# Altium project CHRT.PrjPcb
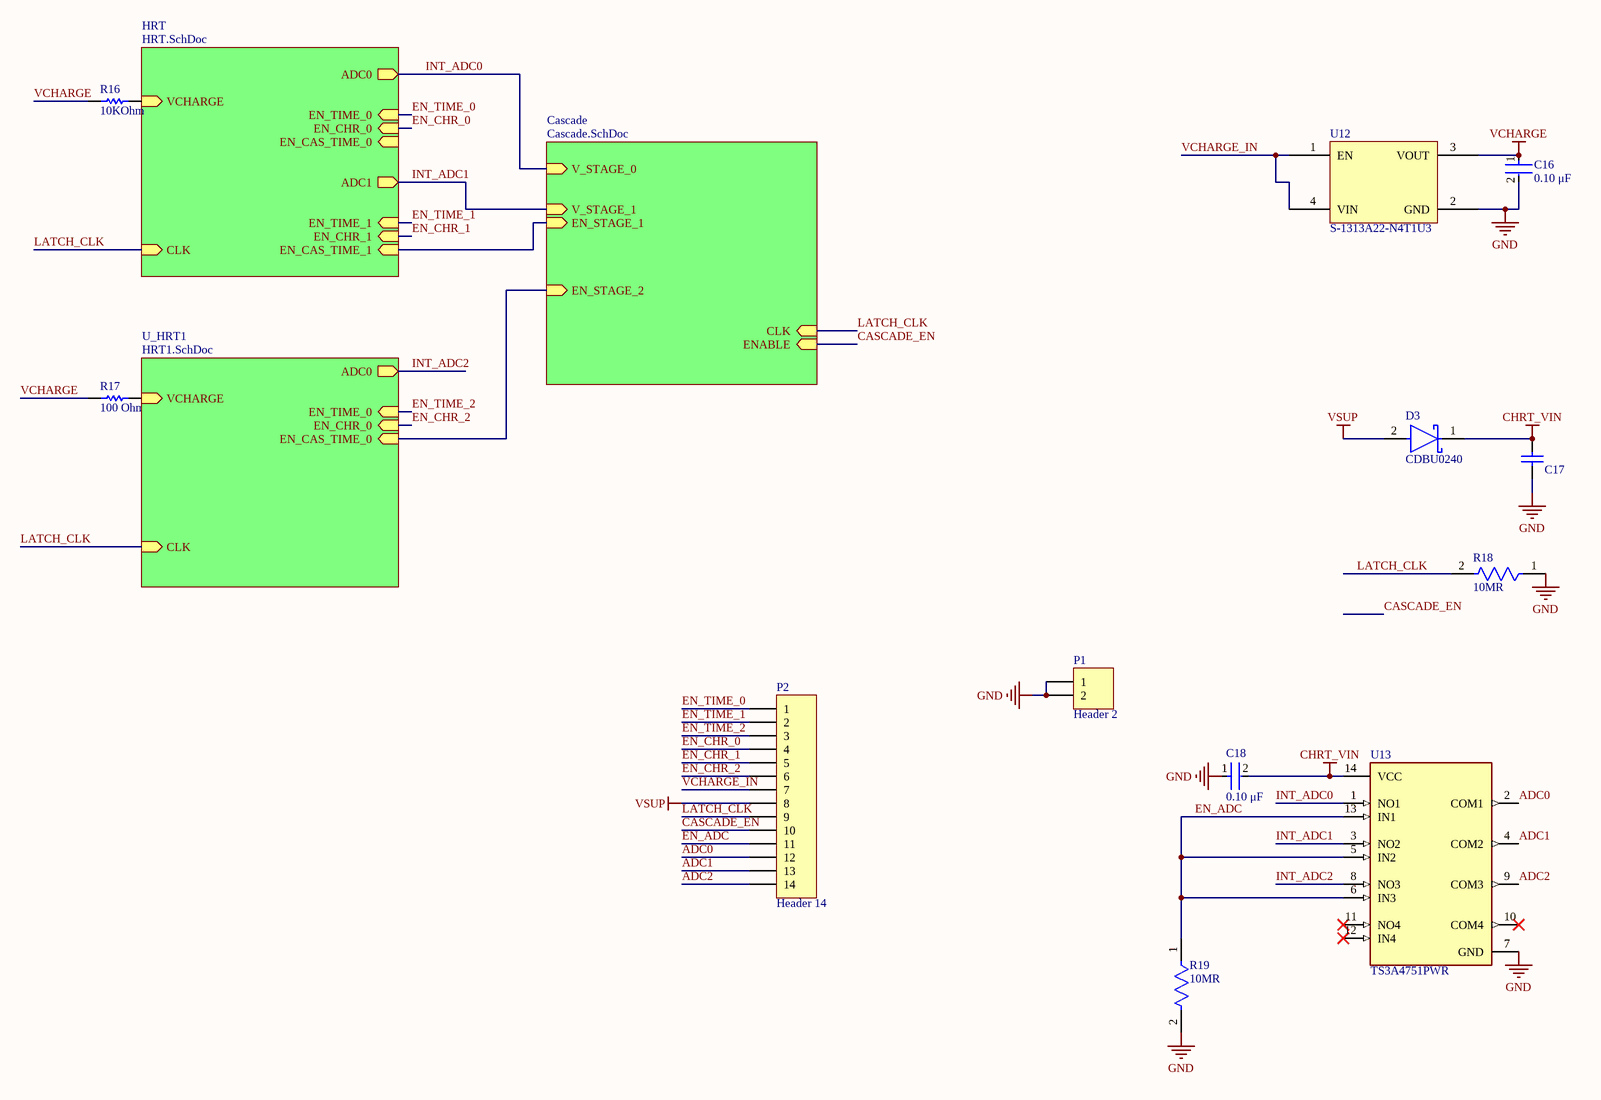
[diagram p0: CHRT.SchDoc]
4 sheets, 55 parts. Net scope: hierarchical (ports join the sheet entries above them; power ports are global).
Board file: PCB1.PcbDoc
Sheets:
  CHRT.SchDoc
    HRT = HRT.SchDoc
    Cascade = Cascade.SchDoc
    U_HRT1 = HRT1.SchDoc

## Sheet CHRT.SchDoc
size A3; SheetNumber: 1; SheetTotal: 4

### Parts
C16  Capacitance: 0.10 μF  [FP-C0402-BB-MFG]  (hidden comment: C0402C104K8PACTU)
C17  ZRB15XR61A106ME01D  [CAPC1005X55X25NL05T10]  (value not drawn)
C18  Capacitance: 0.10 μF  [FP-C0402-BB-MFG]  (hidden comment: C0402C104K8PACTU)
D3  CDBU0240  [FP-SOD-523F-MFG]
P1  Header 2  [HDR1X2]
P2  Header 14  [HDR1X14]
R16  Resistance: 10KOhm  [RESC1005X40X25LL05T05]  (hidden comment: RMCF0402FT10K0)
R17  Resistance: 100 Ohm  [RESC1005X40X25LL05T05]  (hidden comment: ERJ-2RKF1000X)
R18  Resistance: 10MR  [FP-CRCW0402-e3-IPC_C]  (hidden comment: CRCW040210M0JNED)
R19  Resistance: 10MR  [FP-CRCW0402-e3-IPC_C]  (hidden comment: CRCW040210M0JNED)
U12  S-1313A22-N4T1U3  [SC82AB]
U13  TS3A4751PWR  [FP-PW0014A-IPC_C]

### Sub-sheets
Cascade = Cascade.SchDoc: V_STAGE_0 (in), V_STAGE_1 (in), EN_STAGE_1 (in), EN_STAGE_2 (in), CLK (in), ENABLE (in)
HRT = HRT.SchDoc: VCHARGE (in), CLK (in), ADC0 (out), EN_TIME_0 (in), EN_CHR_0 (in), EN_CAS_TIME_0 (in), ADC1 (out), EN_TIME_1 (in), EN_CHR_1 (in), EN_CAS_TIME_1 (in)
U_HRT1 = HRT1.SchDoc: VCHARGE (in), CLK (in), ADC0 (out), EN_TIME_0 (in), EN_CHR_0 (in), EN_CAS_TIME_0 (in)

### Nets
CHRT_VIN: C17.2 C18.2 D3.1(C) U13.14(VCC)
GND: C16.2 C17.1 C18.1 P1.1 P1.2 R18.1 R19.2 U12.2(GND) U13.7(GND)
VCHARGE: C16.1 R16.1 R17.1 U12.3(VOUT)
VSUP: D3.2(A) P2.8
ADC0: P2.12 U13.2(COM1)
ADC1: P2.13 U13.4(COM2)
ADC2: P2.14 U13.9(COM3)
CASCADE_EN: P2.10 ; sheet Cascade/ENABLE
EN_ADC: P2.11 R19.1 U13.5(IN2) U13.6(IN3) U13.13(IN1)
EN_CHR_0: P2.4 ; sheet HRT/EN_CHR_0
EN_CHR_1: P2.5 ; sheet HRT/EN_CHR_1
EN_CHR_2: P2.6 ; sheet U_HRT1/EN_CHR_0
EN_TIME_0: P2.1 ; sheet HRT/EN_TIME_0
EN_TIME_1: P2.2 ; sheet HRT/EN_TIME_1
EN_TIME_2: P2.3 ; sheet U_HRT1/EN_TIME_0
INT_ADC0: U13.1(NO1) ; sheet HRT/ADC0, sheet Cascade/V_STAGE_0
INT_ADC1: U13.3(NO2) ; sheet HRT/ADC1, sheet Cascade/V_STAGE_1
INT_ADC2: U13.8(NO3) ; sheet U_HRT1/ADC0
LATCH_CLK: P2.9 R18.2 ; sheet HRT/CLK, sheet Cascade/CLK, sheet U_HRT1/CLK  [project net CLK]
VCHARGE_IN: P2.7 U12.1(EN) U12.4(VIN)
NetD1_2: R16.2 ; sheet HRT/VCHARGE
NetD2_2: R17.2 ; sheet U_HRT1/VCHARGE
NetR6_2: sheet HRT/EN_CAS_TIME_1, sheet Cascade/EN_STAGE_1
NetR12_2: sheet Cascade/EN_STAGE_2, sheet U_HRT1/EN_CAS_TIME_0

Not connected (* = marked no-connect by the designer): U13 10(COM4)* 11(NO4)* 12(IN4)*

### Library data of the parts
C16 C18 = CMP-2008-02046-2: CAP CER 0.1UF 10V X5R 0402; Manufacturer: Kemet; Material: Ceramic; Temperature Coefficient: 15%; Tolerance: 0.1; Value: 0.10 μF; Package: C0402-BB; Temperature: -55°C to +125°C; ComponentLink2Description: Datasheet; Temperature Characteristic: X5R; Device Class L1: Passive Components; Height: 0.55mm; Lead Free: Yes; ComponentLink2URL: https://content.kemet.com/datasheets/KEM_C1002_X7R_SMD.pdf; Device Class L2: Capacitors; Temperature Range Low: -55°C; Temperature Range High: +125°C; RoHS: TRUE; Octopart: https://octopart.com/c0402c104k8pactu-kemet-140039; Automotive: No; Mouser Description: Capacitor 100 nF 10 VDC 0402; Category: Cap; Voltage Rating: 10 V; Digikey Description: CAP CER 0.1UF 10V X5R 0402; Ipc Land Pattern Name: CAPC10050X50; Device Class L3: Ceramic Capacitors; Manufacturer Part Number: C0402C104K8PACTU
C17 = CMP-2008-04012-1: Manufacturer: Murata; Part Number: GRM155R60G106ME44D; Capacitance: 10uF
D3 = CMP-20227-000007-1: DIODE SCHOTTKY 40V 200MA 0603; Max Reverse Leakage Current: 1uA; Max Surge Current: 2A; Polarity: Standard; Max Power Dissipation: 150mW; Capacitance: 9pF; Voltage Rating (DC): 40V; Average Rectified Current: 200mA; RoHS Compliant: Yes; Package Quantity: 1; Current Rating: 200mA; Lead Free: Lead Free; Output Current: 200mA; Case/Package: SMD/SMT; Mount: Surface Mount; Packaging: Tape and Reel; Max Reverse Voltage (DC): 40V
P1 = Header 2: Header, 2-Pin; LatestRevisionDate: 17-Jul-2002; LatestRevisionNote: Re-released for DXP Platform.; Publisher: Altium Limited
P2 = Header 14: Header, 14-Pin; LatestRevisionDate: 17-Jul-2002; LatestRevisionNote: Re-released for DXP Platform.; Publisher: Altium Limited
R16 = CMP-2000-07588-1: Chip Resistor, 10 KOhm, +/- 1%, 0.1 W, -55 to 155 degC, 0402 (1005 Metric), RoHS, Tape and Reel; Manufacturer: Panasonic; Power Rating: 100mW; Voltage Rating: 50V; Case\/Package: 0402; Temperature Coefficient: 100ppm\/degreesC; RoHSCompliant: True; Lead Free: LeadFree; Package Quantity: 1; Contact Plating: Tin; Length: 1mm; Radiation Hardening: No; REACH SVHC: NoSVHC; Max Operating Temperature: 155degC; Depth: 0.5mm; Case Code (Imperial): 0402; Military Standard: Not; Package Description: 2-Pin Surface Mount Device, Body 1 x 0.5 mm; Termination: SMD/SMT; Case Code (Metric): 1005; Height: 0.35mm; Packaging: TapeandReel; Voltage Rating (DC): 50V; Package Reference: 402; Number of Pins: 2; Tolerance: 1%; Mounting Technology: SurfaceMount; Width: 0.02inch; Mount: SurfaceMount; Datasheet URL: https://industrial.panasonic.com/cdbs/www-data/pdf/RDA0000/AOA0000C304.pdf; Composition: ThickFilm; Datasheet Version: 02/2017; Manufacturer URL: http://www.panasonic.com/; Max Power Dissipation: 100mW; Number of Terminations: 2; Min Operating Temperature: -55degC
R17 = CMP-2002-00605-3: Chip Resistor, 100 Ohm, +/- 1%, 100 mW, -55 to 155 degC, 0402 (1005 Metric), RoHS, Tape and Reel; Manufacturer: Basic Passives; Power Rating: 100 mW; Voltage Rating: 50 V; Case\/Package: 0402; Width: 0.5 mm; Pins: 2; ComponentLink2Description: Datasheet; PackageReference: 0402; Height: 0.35 mm; Tolerance: 1%; DatasheetVersion: 04/2015; Case Code (Imperial): 0402; Min Operating Temperature: -55 degC; Radiation Hardening: No; Length: 1 mm; Package Quantity: 10000; PackageDescription: 2-Pin Surface Mount Device, Body 1 x 0.5 mm; Mounting Technology: Surface Mount; Case Code (Metric): 1005; Packaging: Tape and Reel; ComponentLink1URL: http://www.panasonic.com/; RoHSCompliant: true; Max Operating Temperature: 155 degC; REACH SVHC: Yes; PartNumber: ERJ-2RKF1000X; ComponentLink1Description: Manufacturer URL; ComponentLink2URL: http://industrial.panasonic.com/cdbs/www-data/pdf/RDA0000/AOA0000C86.pdf; Mount: Surface Mount
R18 R19 = CMP-1011-00170-3: RES Thick Film, 10MΩ, 5%, 0.063W, 200ppm/°C, 0402; Voltage Rating (DC): 50V; Max Power Dissipation: 63mW; Case Code (Metric): 1005; Tolerance: 5%; Lead Free: Lead Free; Length: 1mm; Packaging: Tape and Reel; Depth: 0.5mm; Composition: Thick Film; Temperature Coefficient: 200ppm/°C; Package Quantity: 1; Radiation Hardening: No; Weight: 2.3E-05oz; Width: 0.5mm; Military Standard: Not; Power Rating: 63mW; Case/Package: 0402; Termination: SMD/SMT; Height: 0.016inch; Voltage Rating: 50V; Contact Plating: Tin; Number of Terminations: 2; Features: Automotive AEC-Q200; Max Operating Temperature: 155°C; Case Code (Imperial): 0402; Min Operating Temperature: -55°C
U13 = CMP-04892-000059-1: IC SWITCH QUAD SPST 14TSSOP; Bandwidth: 125MHz; High Level Output Current: 100mA; Max Supply Voltage: 3.6V; Operating Supply Voltage: 3V; Polarity: Non-Inverting; Turn-Off Delay Time: 9ns; On-State Resistance: 900mR; Supply Type: Single; Max Supply Current: 75nA; Number of Inputs: 4; Turn-On Delay Time: 14ns; Min Supply Voltage: 1.6V; Packaging: Tape and Reel; Contact Plating: Gold; Mount: Surface Mount; Low Level Output Current: 100mA; Termination: SMD/SMT; Min Operating Temperature: -40°C; Case/Package: TSSOP; REACH SVHC: No SVHC; Weight: 0.002018oz; Number of Pins: 14; Throw Configuration: SPST; Height: 1.05mm; Radiation Hardening: No; Length: 5.1mm; Max Operating Temperature: 85°C; Package Quantity: 1; Lead Free: Lead Free; RoHS Compliant: Yes; Number of Channels: 4; Number of Outputs: 4; Width: 4.5mm

## Sheet HRT.SchDoc
size A; SheetNumber: 2; SheetTotal: 4
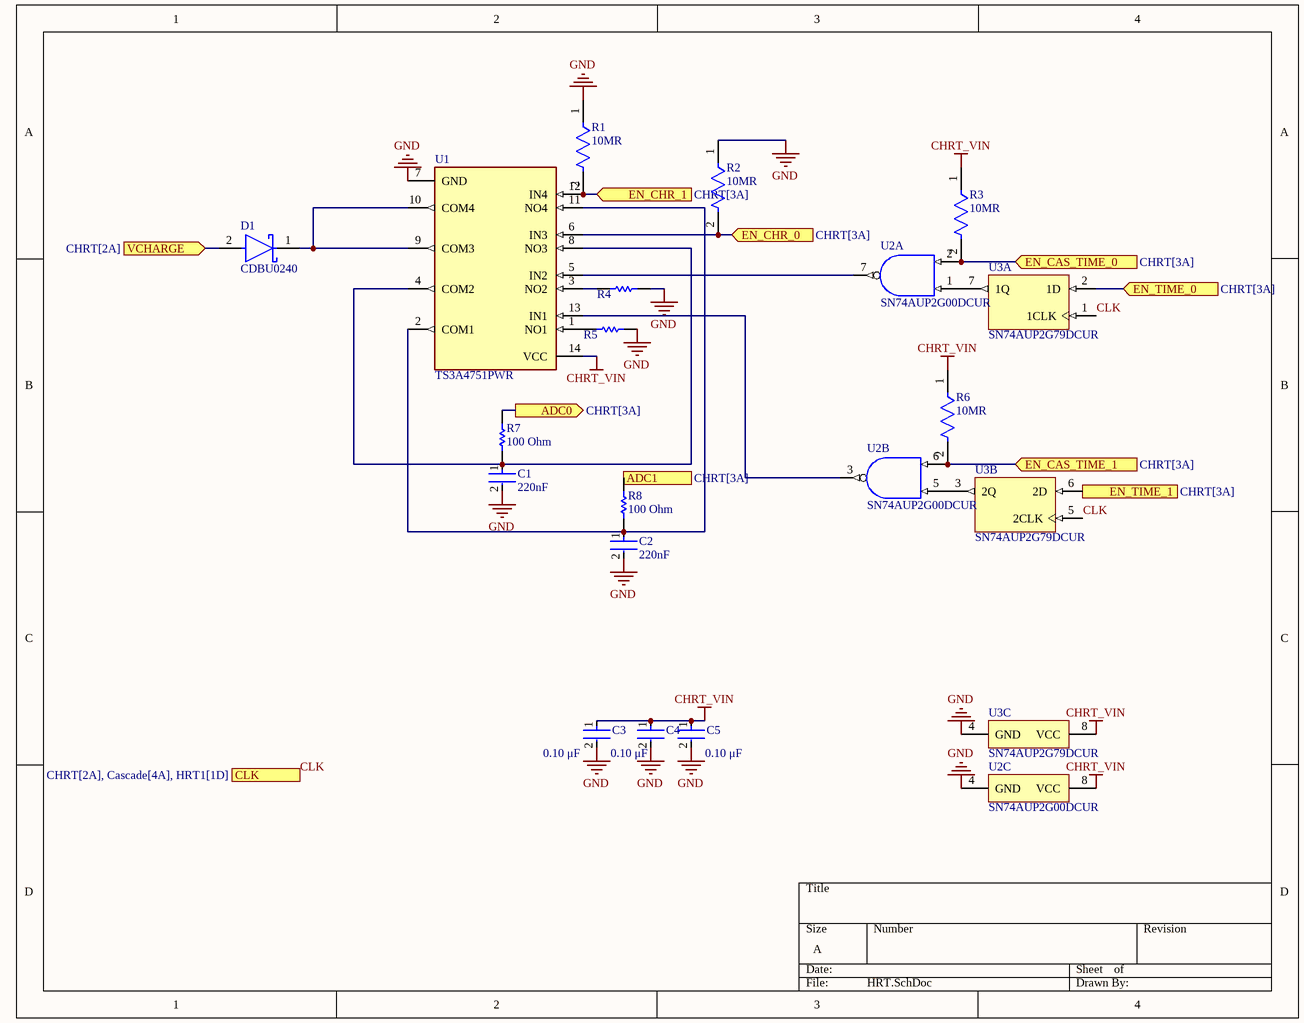
[diagram p1: HRT.SchDoc]

### Parts
C1  Capacitance: 220nF  [FP-GRM155-0_05-IPC_C]  (hidden comment: GRM155R71C224KA12D)
C2  Capacitance: 220nF  [FP-GRM155-0_05-IPC_C]  (hidden comment: GRM155R71C224KA12D)
C3  Capacitance: 0.10 μF  [FP-C0402-BB-MFG]  (hidden comment: C0402C104K8PACTU)
C4  Capacitance: 0.10 μF  [FP-C0402-BB-MFG]  (hidden comment: C0402C104K8PACTU)
C5  Capacitance: 0.10 μF  [FP-C0402-BB-MFG]  (hidden comment: C0402C104K8PACTU)
D1  CDBU0240  [FP-SOD-523F-MFG]
R1  Resistance: 10MR  [FP-CRCW0402-e3-IPC_C]  (hidden comment: CRCW040210M0JNED)
R2  Resistance: 10MR  [FP-CRCW0402-e3-IPC_C]  (hidden comment: CRCW040210M0JNED)
R3  Resistance: 10MR  [FP-CRCW0402-e3-IPC_C]  (hidden comment: CRCW040210M0JNED)
R4  CRCW040222R0FKED  [RESC1005X40X25LL05T05]  (value not drawn)
R5  CRCW040222R0FKED  [RESC1005X40X25LL05T05]  (value not drawn)
R6  Resistance: 10MR  [FP-CRCW0402-e3-IPC_C]  (hidden comment: CRCW040210M0JNED)
R7  Resistance: 100 Ohm  [RESC1005X40X25LL05T05]  (hidden comment: ERJ-2RKF1000X)
R8  Resistance: 100 Ohm  [RESC1005X40X25LL05T05]  (hidden comment: ERJ-2RKF1000X)
U1  TS3A4751PWR  [FP-PW0014A-IPC_C]
U2  SN74AUP2G00DCUR  [DCU0008A_L]  (parts A,B,C of 3)
U3  SN74AUP2G79DCUR  [DCU0008A_L]  (parts A,B,C of 3)

### Ports
ADC0 (out, see CHRT[3A]), ADC1 (out, see CHRT[3A]), CLK (in, see CHRT[2A], Cascade[4A], HRT1[1D]), EN_CAS_TIME_0 (in, see CHRT[3A]), EN_CAS_TIME_1 (in, see CHRT[3A]), EN_CHR_0 (in, see CHRT[3A]), EN_CHR_1 (in, see CHRT[3A]), EN_TIME_0 (in, see CHRT[3A]), EN_TIME_1 (in, see CHRT[3A]), VCHARGE (in, see CHRT[2A])

### Nets
CHRT_VIN: C3.1 C4.1 C5.1 R3.1 R6.1 U1.14(VCC) U2.8(VCC) U3.8(VCC)
GND: C1.2 C2.2 C3.2 C4.2 C5.2 R1.1 R2.1 R4.2 R5.2 U1.7(GND) U2.4(GND) U3.4(GND)
CLK: U3.1(1CLK) U3.5(2CLK) ; port CLK
EN_CHR_0: R2.2 U1.6(IN3) ; port EN_CHR_0
EN_CHR_1: R1.2 U1.12(IN4) ; port EN_CHR_1
EN_TIME_0: U3.2(1D) ; port EN_TIME_0
EN_TIME_1: U3.6(2D) ; port EN_TIME_1
INT_ADC0: R7.2 ; port ADC0
INT_ADC1: R8.2 ; port ADC1
NetC1_1: C1.1 R7.1 U1.4(COM2) U1.8(NO3)
NetC2_1: C2.1 R8.1 U1.2(COM1) U1.11(NO4)
NetD1_1: D1.1(C) U1.9(COM3) U1.10(COM4)
NetD1_2: D1.2(A) ; port VCHARGE
NetR3_2: R3.2 U2.2(1B) ; port EN_CAS_TIME_0
NetR4_1: R4.1 U1.3(NO2)
NetR5_1: R5.1 U1.1(NO1)
NetR6_2: R6.2 U2.6(2B) ; port EN_CAS_TIME_1
NetU1_5: U1.5(IN2) U2.7(1Y)
NetU1_13: U1.13(IN1) U2.3(2Y)
NetU2_1: U2.1(1A) U3.7(1Q)
NetU2_5: U2.5(2A) U3.3(2Q)

### Library data of the parts
C1 C2 = CMP-1034-02089-3: Chip Multilayer Ceramic Capacitors for General Purpose, 0402, 0.22uF, X7R, 15%, 10%, 16V; Depth: 0.5mm; Dielectric: X7R; Min Operating Temperature: -55°C; Package Quantity: 1; Termination: SMD/SMT; Mount: Surface Mount; Radiation Hardening: No; Height: 0.5mm; Case Code (Metric): 1005; Packaging: Tape and Reel; Material: Ceramic; Voltage: 16V; Voltage Rating (DC): 16V; REACH SVHC: No SVHC; Voltage Rating: 16V; Length: 1mm; Tolerance: 10%; Thickness: 0.022inch; Case Code (Imperial): 0402; Max Operating Temperature: 125°C; Width: 0.02inch; Lead Free: Lead Free; Case/Package: 0402
C3-C5 = CMP-2008-02046-2: as C16 on sheet CHRT; Package: C0402-BB; Temperature: -55°C to +125°C; ComponentLink2Description: Datasheet; Temperature Characteristic: X5R; Device Class L1: Passive Components; Height: 0.55mm; Lead Free: Yes; ComponentLink2URL: https://content.kemet.com/datasheets/KEM_C1002_X7R_SMD.pdf; Device Class L2: Capacitors; Temperature Range Low: -55°C; Temperature Range High: +125°C; RoHS: TRUE; Octopart: https://octopart.com/c0402c104k8pactu-kemet-140039; Automotive: No; Mouser Description: Capacitor 100 nF 10 VDC 0402; Category: Cap; Voltage Rating: 10 V; Digikey Description: CAP CER 0.1UF 10V X5R 0402; Ipc Land Pattern Name: CAPC10050X50; Device Class L3: Ceramic Capacitors; Manufacturer Part Number: C0402C104K8PACTU
D1 = CMP-20227-000007-1: as D3 on sheet CHRT; Voltage Rating (DC): 40V; Average Rectified Current: 200mA; RoHS Compliant: Yes; Package Quantity: 1; Current Rating: 200mA; Lead Free: Lead Free; Output Current: 200mA; Case/Package: SMD/SMT; Mount: Surface Mount; Packaging: Tape and Reel; Max Reverse Voltage (DC): 40V
R1-R3 R6 = CMP-1011-00170-3: as R18 on sheet CHRT; Case Code (Metric): 1005; Tolerance: 5%; Lead Free: Lead Free; Length: 1mm; Packaging: Tape and Reel; Depth: 0.5mm; Composition: Thick Film; Temperature Coefficient: 200ppm/°C; Package Quantity: 1; Radiation Hardening: No; Weight: 2.3E-05oz; Width: 0.5mm; Military Standard: Not; Power Rating: 63mW; Case/Package: 0402; Termination: SMD/SMT; Height: 0.016inch; Voltage Rating: 50V; Contact Plating: Tin; Number of Terminations: 2; Features: Automotive AEC-Q200; Max Operating Temperature: 155°C; Case Code (Imperial): 0402; Min Operating Temperature: -55°C
R4 R5 = CMP-2002-08382-1: Manufacturer: Vishay Dale; Part Number: CRCW040222R0FKED
R7 R8 = CMP-2002-00605-3: as R17 on sheet CHRT; Width: 0.5 mm; Pins: 2; ComponentLink2Description: Datasheet; PackageReference: 0402; Height: 0.35 mm; Tolerance: 1%; DatasheetVersion: 04/2015; Case Code (Imperial): 0402; Min Operating Temperature: -55 degC; Radiation Hardening: No; Length: 1 mm; Package Quantity: 10000; PackageDescription: 2-Pin Surface Mount Device, Body 1 x 0.5 mm; Mounting Technology: Surface Mount; Case Code (Metric): 1005; Packaging: Tape and Reel; ComponentLink1URL: http://www.panasonic.com/; RoHSCompliant: true; Max Operating Temperature: 155 degC; REACH SVHC: Yes; PartNumber: ERJ-2RKF1000X; ComponentLink1Description: Manufacturer URL; ComponentLink2URL: http://industrial.panasonic.com/cdbs/www-data/pdf/RDA0000/AOA0000C86.pdf; Mount: Surface Mount
U1 = CMP-04892-000059-1: as U13 on sheet CHRT; Packaging: Tape and Reel; Contact Plating: Gold; Mount: Surface Mount; Low Level Output Current: 100mA; Termination: SMD/SMT; Min Operating Temperature: -40°C; Case/Package: TSSOP; REACH SVHC: No SVHC; Weight: 0.002018oz; Number of Pins: 14; Throw Configuration: SPST; Height: 1.05mm; Radiation Hardening: No; Length: 5.1mm; Max Operating Temperature: 85°C; Package Quantity: 1; Lead Free: Lead Free; RoHS Compliant: Yes; Number of Channels: 4; Number of Outputs: 4; Width: 4.5mm
U2 = CMP-0859-00590-3: Low-Power Dual 2-Input Positive-NAND Gate, DCU0008A, LARGE T&R; Manufacturer: Texas Instruments; tpd @ Nom Voltage(Max)(ns): 31.8,26.3,16.6,12.9,8.8,6.7; 3-State Output: No; Rating: Catalog; Output Type: CMOS; Bits(#): 2; ICC @ Nom Voltage(Max)(mA): 0.0009; Gate Type: NAND; F @ Nom Voltage(Max)(Mhz): 100; Output Drive (IOL/IOH)(Max)(mA): 20/-20; VCC(Min)(V): 0.8; Logic: True; VCC(Max)(V): 3.6; Technology Family: AUP; Voltage(Nom)(V): 0.8,1.2,1.5,1.8,2.5,3.3; Sub-Family: NAND Gate; Generic Part Number: SN74AUP2G00; PackageReference: DCU0008A; Schmitt Trigger: No; Input Type: CMOS; DatasheetVersion: SCES752C; Operating Temperature Range(C): -40 to 85
U3 = CMP-0859-00716-3: Low-Power Dual Positive-Edge-Triggered D-Type Flip-Flop, DCU0008A, LARGE T&R; Manufacturer: Texas Instruments; ICC @ Nom Voltage(Max)(mA): 0.0009; 3-State Output: No; Input Type: CMOS; Rating: Catalog; Output Drive (IOL/IOH)(Max)(mA): 20/-20; VCC(Max)(V): 3.6; Bits(#): 2; Technology Family: AUP; Logic: True; Voltage(Nom)(V): 0.8,1.2,1.5,1.8,2.5,3.3; VCC(Min)(V): 0.8; tpd @ Nom Voltage(Max)(ns): 27.2,17.3,13.3,11.3,7.8,6.3; F @ Nom Voltage(Max)(Mhz): 100; DatasheetVersion: SCES755C; Generic Part Number: SN74AUP2G79; Sub-Family: D-Type Flip-Flop; PackageReference: DCU0008A; Schmitt Trigger: No; Output Type: CMOS; Operating Temperature Range(C): -40 to 85

## Sheet Cascade.SchDoc
size A; SheetNumber: 3; SheetTotal: 4
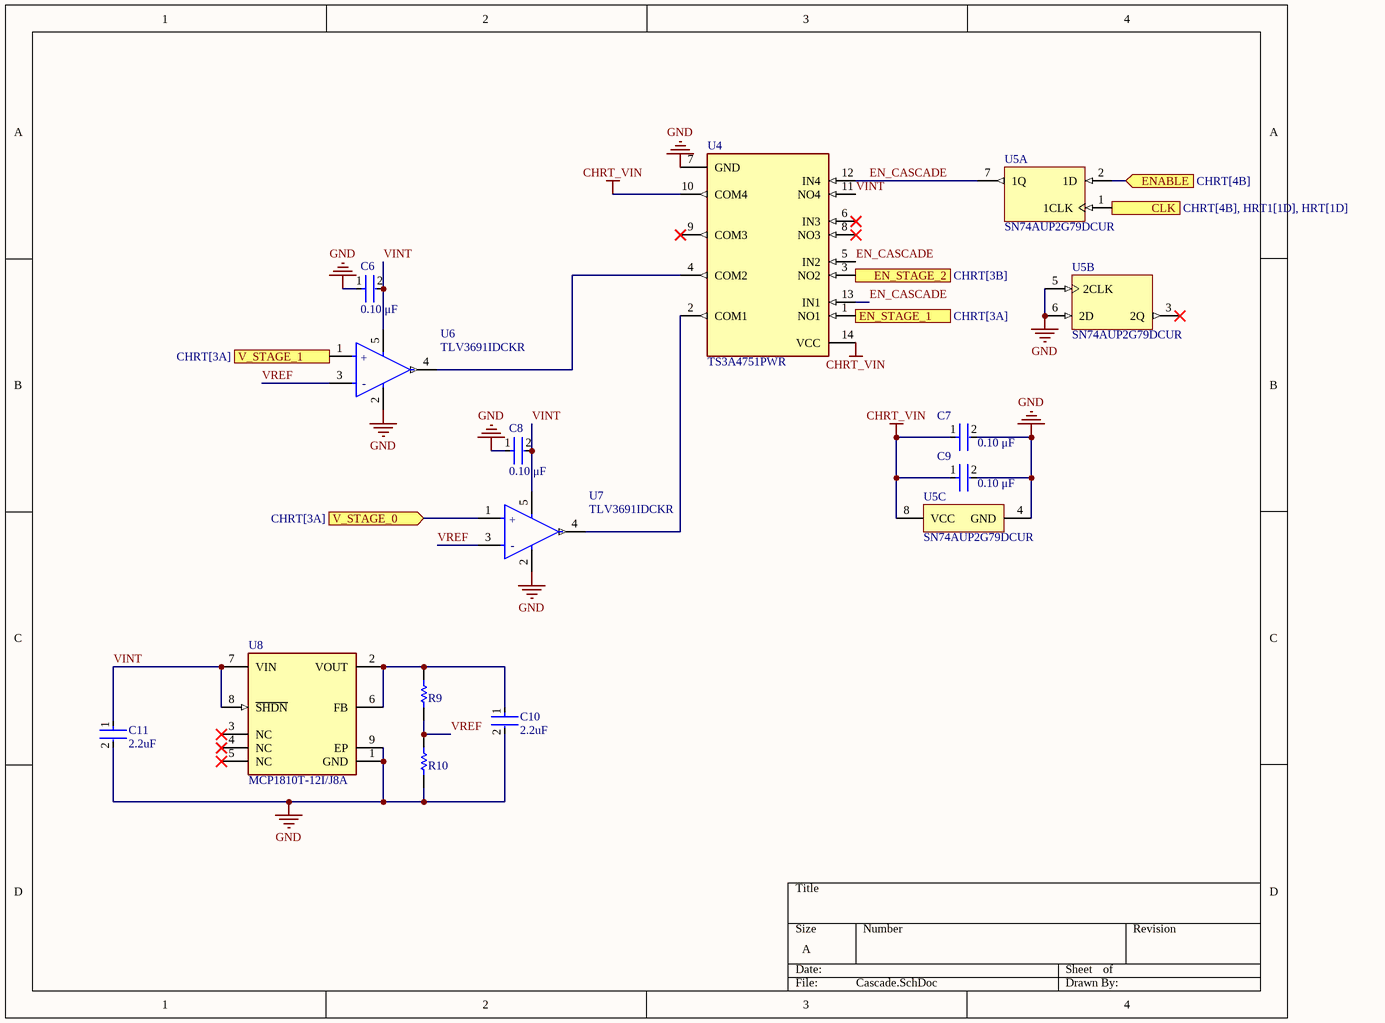
[diagram p2: Cascade.SchDoc]

### Parts
C6  Capacitance: 0.10 μF  [FP-C0402-BB-MFG]  (hidden comment: C0402C104K8PACTU)
C7  Capacitance: 0.10 μF  [FP-C0402-BB-MFG]  (hidden comment: C0402C104K8PACTU)
C8  Capacitance: 0.10 μF  [FP-C0402-BB-MFG]  (hidden comment: C0402C104K8PACTU)
C9  Capacitance: 0.10 μF  [FP-C0402-BB-MFG]  (hidden comment: C0402C104K8PACTU)
C10  Capacitance: 2.2uF  [FP-GRM188-0_1-e0_2_0_5-MFG]  (hidden comment: GRM188R71A225KE15D)
C11  Capacitance: 2.2uF  [FP-GRM188-0_1-e0_2_0_5-MFG]  (hidden comment: GRM188R71A225KE15D)
R9  ERJ-2GEJ915X  [RESC1005X40X25LL05T05]  (value not drawn)
R10  CRCW04022M40FKED  [RESC1005X40X25LL05T05]  (value not drawn)
U4  TS3A4751PWR  [FP-PW0014A-IPC_C]
U5  SN74AUP2G79DCUR  [DCU0008A_L]  (parts A,B,C of 3)
U6  TLV3691IDCKR  [FP-DCK0005A-IPC_A]
U7  TLV3691IDCKR  [FP-DCK0005A-IPC_A]
U8  MCP1810T-12I/J8A  [FP-C04-1207A-MFG]

### Ports
CLK (in, see CHRT[4B], HRT1[1D], HRT[1D]), EN_STAGE_1 (in, see CHRT[3A]), EN_STAGE_2 (in, see CHRT[3B]), ENABLE (in, see CHRT[4B]), V_STAGE_0 (in, see CHRT[3A]), V_STAGE_1 (in, see CHRT[3A])

### Nets
CHRT_VIN: C7.1 C9.1 U4.10(COM4) U4.14(VCC) U5.8(VCC)
GND: C6.1 C7.2 C8.1 C9.2 C10.2 C11.2 R10.2 U4.7(GND) U5.4(GND) U5.5(2CLK) U5.6(2D) U6.2(GND) U7.2(GND) U8.1(GND) U8.9(EP)
CASCADE_EN: U5.2(1D) ; port ENABLE
CLK: U5.1(1CLK) ; port CLK
EN_CASCADE: U4.5(IN2) U4.12(IN4) U4.13(IN1) U5.7(1Q)
INT_ADC0: U7.1(IN+) ; port V_STAGE_0
INT_ADC1: U6.1(IN+) ; port V_STAGE_1
VINT: C6.2 C8.2 C11.1 U4.11(NO4) U6.5(VCC) U7.5(VCC) U8.7(VIN) U8.8(~{SHDN})
VREF: R9.1 R10.1 U6.3(IN-) U7.3(IN-)
NetC10_1: C10.1 R9.2 U8.2(VOUT) U8.6(FB)
NetR6_2: U4.1(NO1) ; port EN_STAGE_1
NetR12_2: U4.3(NO2) ; port EN_STAGE_2
NetU4_2: U4.2(COM1) U7.4(OUT)
NetU4_4: U4.4(COM2) U6.4(OUT)

Not connected (* = marked no-connect by the designer): U4 6(IN3)* 8(NO3)* 9(COM3)*; U5 3(2Q)*; U8 3(NC)* 4(NC)* 5(NC)*

### Notes on the sheet
- (in symbol CMP-04896-000044-1) +; -

### Library data of the parts
C6-C9 = CMP-2008-02046-2: as C16 on sheet CHRT; Package: C0402-BB; Temperature: -55°C to +125°C; ComponentLink2Description: Datasheet; Temperature Characteristic: X5R; Device Class L1: Passive Components; Height: 0.55mm; Lead Free: Yes; ComponentLink2URL: https://content.kemet.com/datasheets/KEM_C1002_X7R_SMD.pdf; Device Class L2: Capacitors; Temperature Range Low: -55°C; Temperature Range High: +125°C; RoHS: TRUE; Octopart: https://octopart.com/c0402c104k8pactu-kemet-140039; Automotive: No; Mouser Description: Capacitor 100 nF 10 VDC 0402; Category: Cap; Voltage Rating: 10 V; Digikey Description: CAP CER 0.1UF 10V X5R 0402; Ipc Land Pattern Name: CAPC10050X50; Device Class L3: Ceramic Capacitors; Manufacturer Part Number: C0402C104K8PACTU
C10 C11 = CMP-2006-02836-2: Chip Multilayer Ceramic Capacitors for General Purpose, 0603, 2.2uF, X7R, 15%, 10%, 10V; Case Code (Metric): 1608; Height: 0.8mm; Packaging: Cut Tape; Voltage: 10V; Lead Free: Lead Free; Min Operating Temperature: -55°C; Voltage Rating (DC): 10V; Max Operating Temperature: 125°C; Voltage Rating: 10V; Dielectric: X7R; Depth: 0.8mm; Case Code (Imperial): 0603; Termination: SMD/SMT; Case/Package: 0603; Number of Pins: 2; REACH SVHC: No SVHC; Mount: Surface Mount; Width: 0.031inch; Material: Ceramic; Package Quantity: 1; Weight: 7.1E-05oz; Length: 1.6mm; Thickness: 0.035inch; Tolerance: 10%
R9 = CMP-2002-00597-1: Manufacturer: Panasonic; Part Number: ERJ-2GEJ915X
R10 = CMP-1011-00890-2: Manufacturer: Vishay Dale; Part Number: CRCW04022M40FKED
U4 = CMP-04892-000059-1: as U13 on sheet CHRT; Packaging: Tape and Reel; Contact Plating: Gold; Mount: Surface Mount; Low Level Output Current: 100mA; Termination: SMD/SMT; Min Operating Temperature: -40°C; Case/Package: TSSOP; REACH SVHC: No SVHC; Weight: 0.002018oz; Number of Pins: 14; Throw Configuration: SPST; Height: 1.05mm; Radiation Hardening: No; Length: 5.1mm; Max Operating Temperature: 85°C; Package Quantity: 1; Lead Free: Lead Free; RoHS Compliant: Yes; Number of Channels: 4; Number of Outputs: 4; Width: 4.5mm
U5 = CMP-0859-00716-3: as U3 on sheet HRT; DatasheetVersion: SCES755C; Generic Part Number: SN74AUP2G79; Sub-Family: D-Type Flip-Flop; PackageReference: DCU0008A; Schmitt Trigger: No; Output Type: CMOS; Operating Temperature Range(C): -40 to 85
U6 U7 = CMP-04896-000044-1: IC COMPARATOR NANO-POWER SC70-5; Max Supply Voltage: 6.5V; Propagation Delay: 35us; Quiescent Current: 150nA; Max Input Current: 100pA; Min Supply Voltage: 900mV; Number of Elements: 1; Min Dual Supply Voltage: 450mV; Max Dual Supply Voltage: 3.25V; Output Current: 42mA; Input Offset Voltage (Vos): 3mV; Response Time: 24us; Packaging: Tape and Reel; Type: General Purpose; RoHS Compliant: Yes; Number of Pins: 5; Max Operating Temperature: 125°C; Input Bias Current: 100pA; Mount: Surface Mount; Radiation Hardening: No; Contact Plating: Gold; Number of Channels: 1; Min Operating Temperature: -40°C; Package Quantity: 3000; Lead Free: Lead Free; Case/Package: SC
U8 = CMP-06324-000006-1: IC REG LINEAR 1.2V 150MA 8VDFN; Manufacturer: Microchip Technology; Number Of Outputs: 1; Max Junction Temp: +150°C; Dropout Voltage: 380mV; Standoff Height: 0mm; Nominal Supply Current: 0.02uA; Min Supply Voltage: 2.5V; Max Supply Voltage: 5.5V; Output Type: Fixed; Temperature: -40°C to +85°C; Output Voltage: 1.2V; Device Class L1: Integrated Circuits (ICs); Digikey Description: IC REG LINEAR 1.2V 150MA 8VDFN; Automotive: No; Manufacturer Part Number: MCP1810T-12I/J8A; Device Class L3: Voltage Regulators - Linear; Temperature Range Low: -40°C; Package: C04-1207A; Temperature Range High: +85°C; Height: 0.9mm; ComponentLink2Description: Datasheet; Ipc Land Pattern Name: DFN200X200X85-8; Octopart: https://octopart.com/mcp1810t-12i%2Fj8a-microchip-75615047; Device Class L2: Power Management ICs; Lead Free: Yes; Category: IC; ComponentLink2URL: http://ww1.microchip.com/downloads/en/DeviceDoc/20005623B.pdf; RoHS: TRUE; Output Current: 150mA

## Sheet HRT1.SchDoc
size A; SheetNumber: 4; SheetTotal: 4
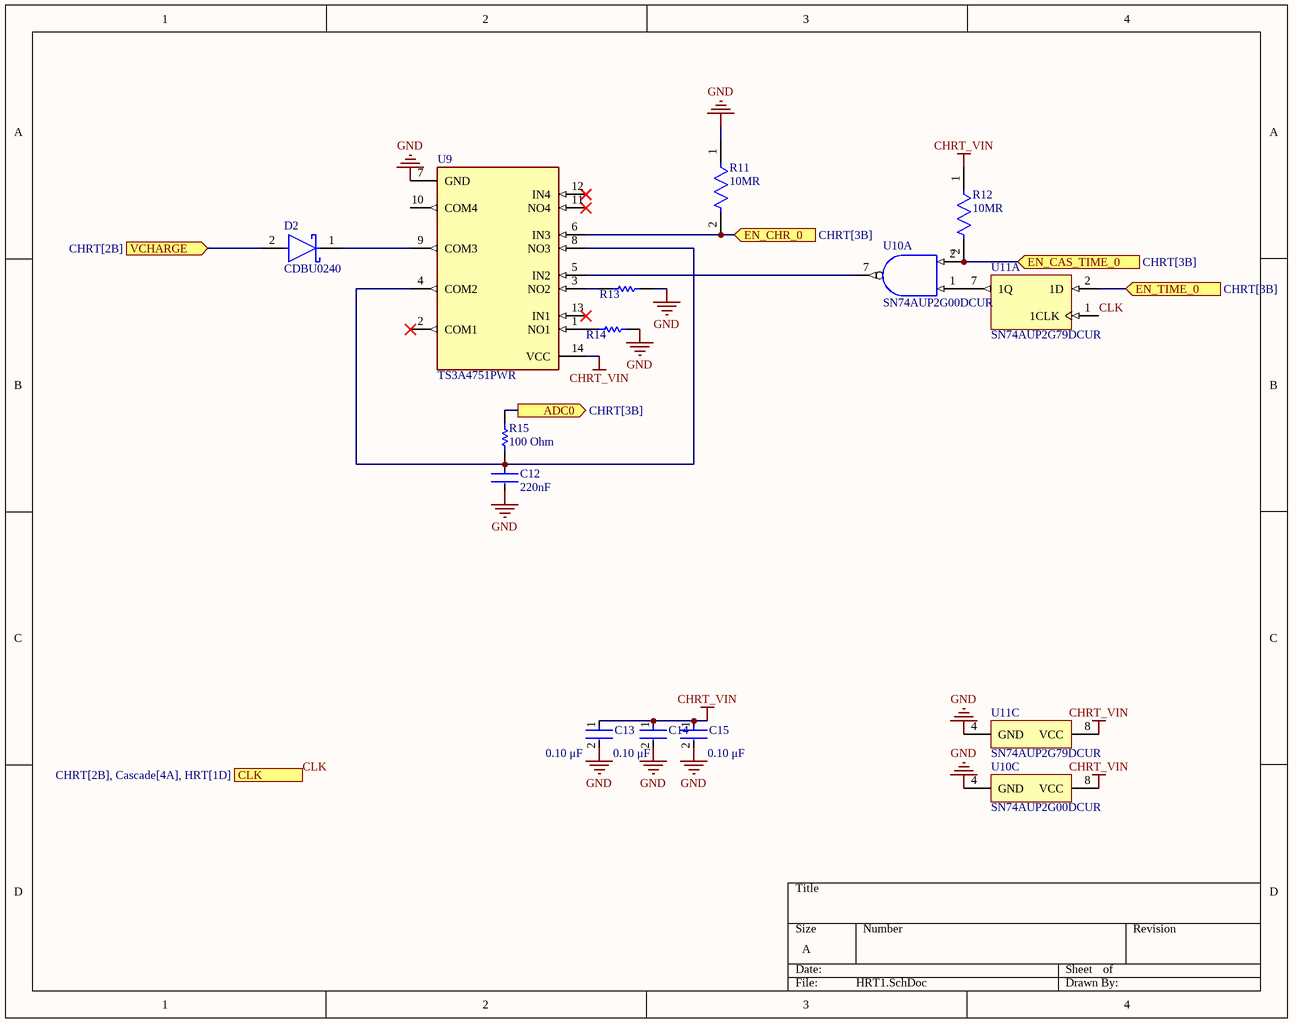
[diagram p3: HRT1.SchDoc]

### Parts
C12  Capacitance: 220nF  [FP-GRM155-0_05-IPC_C]  (hidden comment: GRM155R71C224KA12D)
C13  Capacitance: 0.10 μF  [FP-C0402-BB-MFG]  (hidden comment: C0402C104K8PACTU)
C14  Capacitance: 0.10 μF  [FP-C0402-BB-MFG]  (hidden comment: C0402C104K8PACTU)
C15  Capacitance: 0.10 μF  [FP-C0402-BB-MFG]  (hidden comment: C0402C104K8PACTU)
D2  CDBU0240  [FP-SOD-523F-MFG]
R11  Resistance: 10MR  [FP-CRCW0402-e3-IPC_C]  (hidden comment: CRCW040210M0JNED)
R12  Resistance: 10MR  [FP-CRCW0402-e3-IPC_C]  (hidden comment: CRCW040210M0JNED)
R13  CRCW040222R0FKED  [RESC1005X40X25LL05T05]  (value not drawn)
R14  CRCW040222R0FKED  [RESC1005X40X25LL05T05]  (value not drawn)
R15  Resistance: 100 Ohm  [RESC1005X40X25LL05T05]  (hidden comment: ERJ-2RKF1000X)
U9  TS3A4751PWR  [FP-PW0014A-IPC_C]
U10  SN74AUP2G00DCUR  [DCU0008A_L]  (parts A,C of 3)
U11  SN74AUP2G79DCUR  [DCU0008A_L]  (parts A,C of 3)

### Ports
ADC0 (out, see CHRT[3B]), CLK (in, see CHRT[2B], Cascade[4A], HRT[1D]), EN_CAS_TIME_0 (in, see CHRT[3B]), EN_CHR_0 (in, see CHRT[3B]), EN_TIME_0 (in, see CHRT[3B]), VCHARGE (in, see CHRT[2B])

### Nets
CHRT_VIN: C13.1 C14.1 C15.1 R12.1 U9.14(VCC) U10.8(VCC) U11.8(VCC)
GND: C12.2 C13.2 C14.2 C15.2 R11.1 R13.2 R14.2 U9.7(GND) U10.4(GND) U11.4(GND)
CLK: U11.1(1CLK) ; port CLK
EN_CHR_2: R11.2 U9.6(IN3) ; port EN_CHR_0
EN_TIME_2: U11.2(1D) ; port EN_TIME_0
INT_ADC2: R15.2 ; port ADC0
NetC12_1: C12.1 R15.1 U9.4(COM2) U9.8(NO3)
NetD2_1: D2.1(C) U9.9(COM3)
NetD2_2: D2.2(A) ; port VCHARGE
NetR12_2: R12.2 U10.2(1B) ; port EN_CAS_TIME_0
NetR13_1: R13.1 U9.3(NO2)
NetR14_1: R14.1 U9.1(NO1)
NetU9_5: U9.5(IN2) U10.7(1Y)
NetU10_1: U10.1(1A) U11.7(1Q)

Not connected (* = marked no-connect by the designer): U9 2(COM1)* 10(COM4) 11(NO4)* 12(IN4)* 13(IN1)*

### Library data of the parts
C12 = CMP-1034-02089-3: as C1 on sheet HRT; Depth: 0.5mm; Dielectric: X7R; Min Operating Temperature: -55°C; Package Quantity: 1; Termination: SMD/SMT; Mount: Surface Mount; Radiation Hardening: No; Height: 0.5mm; Case Code (Metric): 1005; Packaging: Tape and Reel; Material: Ceramic; Voltage: 16V; Voltage Rating (DC): 16V; REACH SVHC: No SVHC; Voltage Rating: 16V; Length: 1mm; Tolerance: 10%; Thickness: 0.022inch; Case Code (Imperial): 0402; Max Operating Temperature: 125°C; Width: 0.02inch; Lead Free: Lead Free; Case/Package: 0402
C13-C15 = CMP-2008-02046-2: as C16 on sheet CHRT; Package: C0402-BB; Temperature: -55°C to +125°C; ComponentLink2Description: Datasheet; Temperature Characteristic: X5R; Device Class L1: Passive Components; Height: 0.55mm; Lead Free: Yes; ComponentLink2URL: https://content.kemet.com/datasheets/KEM_C1002_X7R_SMD.pdf; Device Class L2: Capacitors; Temperature Range Low: -55°C; Temperature Range High: +125°C; RoHS: TRUE; Octopart: https://octopart.com/c0402c104k8pactu-kemet-140039; Automotive: No; Mouser Description: Capacitor 100 nF 10 VDC 0402; Category: Cap; Voltage Rating: 10 V; Digikey Description: CAP CER 0.1UF 10V X5R 0402; Ipc Land Pattern Name: CAPC10050X50; Device Class L3: Ceramic Capacitors; Manufacturer Part Number: C0402C104K8PACTU
D2 = CMP-20227-000007-1: as D3 on sheet CHRT; Voltage Rating (DC): 40V; Average Rectified Current: 200mA; RoHS Compliant: Yes; Package Quantity: 1; Current Rating: 200mA; Lead Free: Lead Free; Output Current: 200mA; Case/Package: SMD/SMT; Mount: Surface Mount; Packaging: Tape and Reel; Max Reverse Voltage (DC): 40V
R11 R12 = CMP-1011-00170-3: as R18 on sheet CHRT; Case Code (Metric): 1005; Tolerance: 5%; Lead Free: Lead Free; Length: 1mm; Packaging: Tape and Reel; Depth: 0.5mm; Composition: Thick Film; Temperature Coefficient: 200ppm/°C; Package Quantity: 1; Radiation Hardening: No; Weight: 2.3E-05oz; Width: 0.5mm; Military Standard: Not; Power Rating: 63mW; Case/Package: 0402; Termination: SMD/SMT; Height: 0.016inch; Voltage Rating: 50V; Contact Plating: Tin; Number of Terminations: 2; Features: Automotive AEC-Q200; Max Operating Temperature: 155°C; Case Code (Imperial): 0402; Min Operating Temperature: -55°C
R13 R14 = CMP-2002-08382-1: Manufacturer: Vishay Dale; Part Number: CRCW040222R0FKED
R15 = CMP-2002-00605-3: as R17 on sheet CHRT; Width: 0.5 mm; Pins: 2; ComponentLink2Description: Datasheet; PackageReference: 0402; Height: 0.35 mm; Tolerance: 1%; DatasheetVersion: 04/2015; Case Code (Imperial): 0402; Min Operating Temperature: -55 degC; Radiation Hardening: No; Length: 1 mm; Package Quantity: 10000; PackageDescription: 2-Pin Surface Mount Device, Body 1 x 0.5 mm; Mounting Technology: Surface Mount; Case Code (Metric): 1005; Packaging: Tape and Reel; ComponentLink1URL: http://www.panasonic.com/; RoHSCompliant: true; Max Operating Temperature: 155 degC; REACH SVHC: Yes; PartNumber: ERJ-2RKF1000X; ComponentLink1Description: Manufacturer URL; ComponentLink2URL: http://industrial.panasonic.com/cdbs/www-data/pdf/RDA0000/AOA0000C86.pdf; Mount: Surface Mount
U9 = CMP-04892-000059-1: as U13 on sheet CHRT; Packaging: Tape and Reel; Contact Plating: Gold; Mount: Surface Mount; Low Level Output Current: 100mA; Termination: SMD/SMT; Min Operating Temperature: -40°C; Case/Package: TSSOP; REACH SVHC: No SVHC; Weight: 0.002018oz; Number of Pins: 14; Throw Configuration: SPST; Height: 1.05mm; Radiation Hardening: No; Length: 5.1mm; Max Operating Temperature: 85°C; Package Quantity: 1; Lead Free: Lead Free; RoHS Compliant: Yes; Number of Channels: 4; Number of Outputs: 4; Width: 4.5mm
U10 = CMP-0859-00590-3: as U2 on sheet HRT; Sub-Family: NAND Gate; Generic Part Number: SN74AUP2G00; PackageReference: DCU0008A; Schmitt Trigger: No; Input Type: CMOS; DatasheetVersion: SCES752C; Operating Temperature Range(C): -40 to 85
U11 = CMP-0859-00716-3: as U3 on sheet HRT; DatasheetVersion: SCES755C; Generic Part Number: SN74AUP2G79; Sub-Family: D-Type Flip-Flop; PackageReference: DCU0008A; Schmitt Trigger: No; Output Type: CMOS; Operating Temperature Range(C): -40 to 85

## Nets that join several sheets
CHRT_VIN: CHRT (C17.2 C18.2 D3.1 U13.14), HRT (8 pins), Cascade (5 pins), HRT1 (7 pins)
GND: CHRT (9 pins), HRT (12 pins), Cascade (15 pins), HRT1 (10 pins)
CASCADE_EN: CHRT (P2.10), Cascade (U5.2)
CLK: CHRT (P2.9 R18.2), HRT (U3.1 U3.5), Cascade (U5.1), HRT1 (U11.1)
EN_CHR_0: CHRT (P2.4), HRT (R2.2 U1.6)
EN_CHR_1: CHRT (P2.5), HRT (R1.2 U1.12)
EN_CHR_2: CHRT (P2.6), HRT1 (R11.2 U9.6)
EN_TIME_0: CHRT (P2.1), HRT (U3.2)
EN_TIME_1: CHRT (P2.2), HRT (U3.6)
EN_TIME_2: CHRT (P2.3), HRT1 (U11.2)
INT_ADC0: CHRT (U13.1), HRT (R7.2), Cascade (U7.1)
INT_ADC1: CHRT (U13.3), HRT (R8.2), Cascade (U6.1)
INT_ADC2: CHRT (U13.8), HRT1 (R15.2)
NetD1_2: CHRT (R16.2), HRT (D1.2)
NetD2_2: CHRT (R17.2), HRT1 (D2.2)
NetR6_2: HRT (R6.2 U2.6), Cascade (U4.1)
NetR12_2: Cascade (U4.3), HRT1 (R12.2 U10.2)